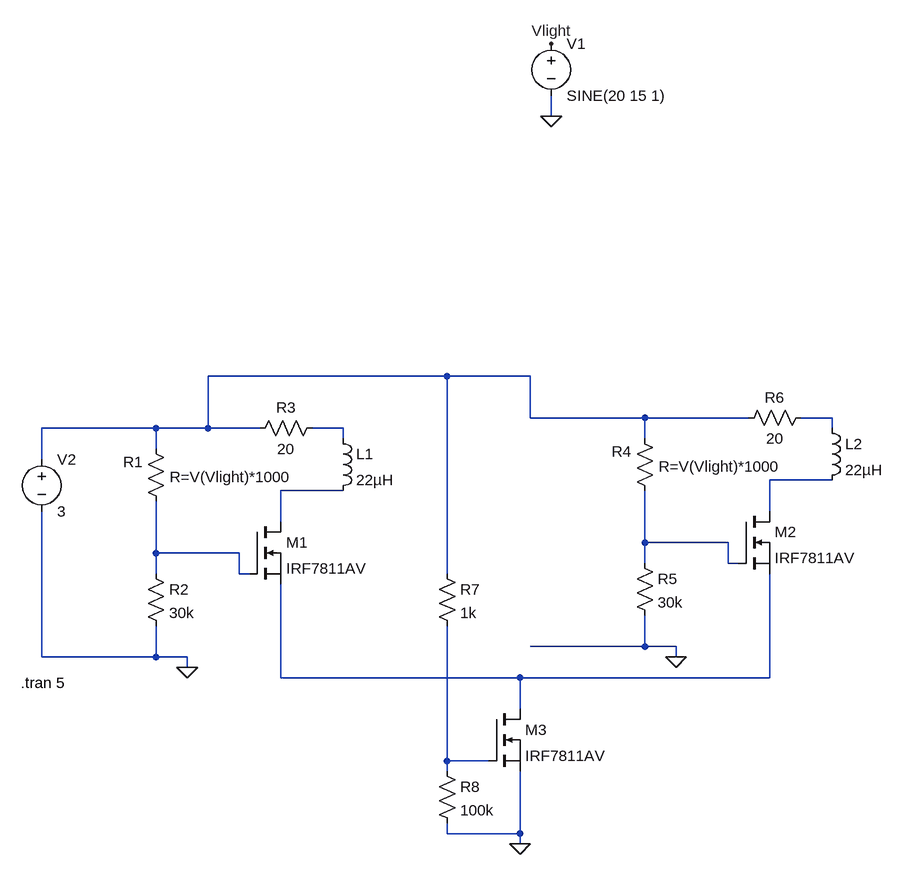
[diagram p0: schematic light_motor_control.asc]
light_motor_control.asc, the LTspice schematic file:
Version 4
SHEET 1 1128 680
WIRE 608 -560 608 -592
WIRE 448 -160 80 -160
WIRE 576 -160 448 -160
WIRE 576 -96 576 -160
WIRE 752 -96 576 -96
WIRE 912 -96 752 -96
WIRE 1040 -96 992 -96
WIRE 0 -80 -176 -80
WIRE 80 -80 80 -160
WIRE 80 -80 0 -80
WIRE 160 -80 80 -80
WIRE 288 -80 240 -80
WIRE 1040 -80 1040 -96
WIRE 288 -64 288 -80
WIRE 752 -64 752 -96
WIRE 0 -48 0 -80
WIRE -176 -32 -176 -80
WIRE 1040 0 944 0
WIRE 288 16 192 16
WIRE 944 48 944 0
WIRE 192 64 192 16
WIRE 752 96 752 16
WIRE 880 96 752 96
WIRE 0 112 0 32
WIRE 128 112 0 112
WIRE 752 128 752 96
WIRE 880 128 880 96
WIRE 896 128 880 128
WIRE 0 144 0 112
WIRE 128 144 128 112
WIRE 144 144 128 144
WIRE 448 144 448 -160
WIRE 752 256 752 208
WIRE 752 256 576 256
WIRE 800 256 752 256
WIRE -176 272 -176 48
WIRE 0 272 0 224
WIRE 0 272 -176 272
WIRE 48 272 0 272
WIRE 800 272 800 256
WIRE 48 288 48 272
WIRE 192 304 192 160
WIRE 560 304 192 304
WIRE 944 304 944 144
WIRE 944 304 560 304
WIRE 560 352 560 304
WIRE 448 432 448 224
WIRE 512 432 448 432
WIRE 448 448 448 432
WIRE 448 544 448 528
WIRE 560 544 560 448
WIRE 560 544 448 544
WIRE 560 560 560 544
FLAG 48 288 0
FLAG 608 -560 0
FLAG 608 -672 Vlight
FLAG 800 272 0
FLAG 560 560 0
SYMBOL voltage -176 -48 R0
WINDOW 123 0 0 Left 2
WINDOW 39 0 0 Left 2
SYMATTR InstName V2
SYMATTR Value 3
SYMBOL voltage 608 -688 R0
WINDOW 123 0 0 Left 2
WINDOW 39 0 0 Left 2
SYMATTR InstName V1
SYMATTR Value SINE(20 15 1)
SYMBOL res 16 48 R180
WINDOW 0 36 76 Left 2
WINDOW 3 -192 53 Left 2
SYMATTR InstName R1
SYMATTR Value R=V(Vlight)*1000
SYMBOL nmos 144 64 R0
SYMATTR InstName M1
SYMATTR Value IRF7811AV
SYMBOL ind 272 -80 R0
SYMATTR InstName L1
SYMATTR Value 22µH
SYMBOL res -16 128 R0
SYMATTR InstName R2
SYMATTR Value 30k
SYMBOL res 256 -96 R90
WINDOW 0 0 56 VBottom 2
WINDOW 3 32 56 VTop 2
SYMATTR InstName R3
SYMATTR Value 20
SYMBOL res 768 32 R180
WINDOW 0 36 76 Left 2
WINDOW 3 -192 53 Left 2
SYMATTR InstName R4
SYMATTR Value R=V(Vlight)*1000
SYMBOL nmos 896 48 R0
SYMATTR InstName M2
SYMATTR Value IRF7811AV
SYMBOL ind 1024 -96 R0
SYMATTR InstName L2
SYMATTR Value 22µH
SYMBOL res 736 112 R0
SYMATTR InstName R5
SYMATTR Value 30k
SYMBOL res 1008 -112 R90
WINDOW 0 0 56 VBottom 2
WINDOW 3 32 56 VTop 2
SYMATTR InstName R6
SYMATTR Value 20
SYMBOL nmos 512 352 R0
SYMATTR InstName M3
SYMATTR Value IRF7811AV
SYMBOL res 432 128 R0
SYMATTR InstName R7
SYMATTR Value 1k
SYMBOL res 432 432 R0
SYMATTR InstName R8
SYMATTR Value 100k
TEXT -208 312 Left 2 !.tran 5

The netlist it stands for:
* light_motor_control.asc
V2 N001 0 3
V1 Vlight 0 SINE(20 15 1)
R1 N007 N001 R=V(Vlight)*1000
M1 N005 N007 N008 N008 IRF7811AV
L1 N003 N005 22µH
R2 N007 0 30k
R3 N003 N001 20
R4 N006 N001 R=V(Vlight)*1000
M2 N004 N006 N008 N008 IRF7811AV
L2 N002 N004 22µH
R5 N006 0 30k
R6 N002 N001 20
M3 N008 N009 0 0 IRF7811AV
R7 N001 N009 1k
R8 N009 0 100k
.model NMOS NMOS
.model PMOS PMOS
.lib standard.mos
.tran 5
.backanno
.end